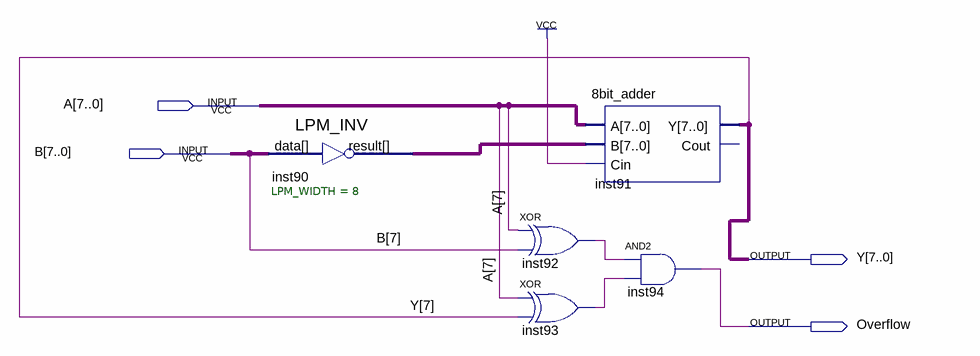
[diagram p0: schematic sheet]
// Quartus schematic substract.bdf as structural Verilog: 5 symbols, 4 pins
module substract (
  input  [7:0] A,
  input  [7:0] B,
  output [7:0] Y,
  output Overflow
);

  wire inst92_out, inst93_out;
  wire [7:0] inst90_result;

  LPM_INV #(.LPM_WIDTH(8)) inst90 (.data(B), .result(inst90_result));
  xor inst92 (inst92_out, A[7], B[7]);
  xor inst93 (inst93_out, A[7], Y[7]);
  \8bit_adder  inst91 (.A(A), .B(inst90_result), .Cin(1'b1), .Y(Y));  // open: Cout
  and inst94 (Overflow, inst92_out, inst93_out);
endmodule
